# Altium schematic sheet SR.SchDoc
size A4; SheetNumber: 5; SheetTotal: 5
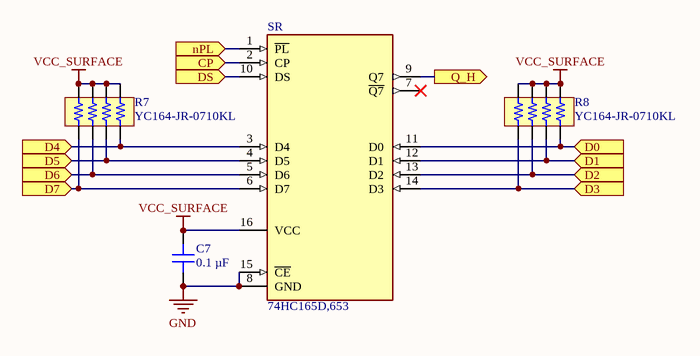
[diagram p0: SR.SchDoc]

## Parts
C7  0.1 µF  [CAP 0603_1608]
R7  YC164-JR-0710KL  [RESNET 1206-8 CONVEX]
R8  YC164-JR-0710KL  [RESNET 1206-8 CONVEX]
SR  74HC165D,653  [FP-SOT109-1-MFG]

## Ports
CP (in), D0 (in), D1 (in), D2 (in), D3 (in), D4 (in), D5 (in), D6 (in), D7 (in), DS (in), nPL (in), Q_H (out)

## Nets
GND: C7.1 SR.8(GND) SR.15(~{CE})
VCC_SURFACE: C7.2 R7.5 R7.6 R7.7 R7.8 R8.5 R8.6 R8.7 R8.8 SR.16(VCC)
CP: SR.2(CP) ; port CP
D0: R8.4 SR.11(D0) ; port D0
D1: R8.3 SR.12(D1) ; port D1
D2: R8.2 SR.13(D2) ; port D2
D3: R8.1 SR.14(D3) ; port D3
D4: R7.4 SR.3(D4) ; port D4
D5: R7.3 SR.4(D5) ; port D5
D6: R7.2 SR.5(D6) ; port D6
D7: R7.1 SR.6(D7) ; port D7
DS: SR.10(DS) ; port DS
nPL: SR.1(~{PL}) ; port nPL
Q_H: SR.9(Q7) ; port Q_H

Not connected (* = marked no-connect by the designer): SR 7(~{Q7})*

## Library data of the parts
C7 = CC0603KPX7R7BB104: CAP CER 0.1UF 16V X7R 0603; manufacturer: Yageo; Tolerance: ±10%; Part Number: CC0603KPX7R7BB104; Value: 0.1 µF; Applications: General Purpose; Capacitance: 0.1 µF; componentlink1description: Datasheet; componentlink1url: https://www.yageo.com/upload/media/product/productsearch/datasheet/mlcc/UPY-GPHC_X7R_6.3V-to-50V_18.pdf; componentlink2description: DigiKey Link; componentlink2url: https://www.digikey.com/en/products/detail/yageo/CC0603KPX7R7BB104/2103073; Device Package: 0603 (1608 Metric); lastupdated: 2/9/2024 8:10:09 PM; Lifecycle Status: Active; Minimum Order: 1; Mounting Type: Surface Mount, MLCC; Operating Temperature: -55°C ~ 125°C; Package / Case: 0603 (1608 Metric); packaging: TapeAndReel; partid: 16718; Part Status: Active; price: 0.01; series: CC; Size / Dimension: 0.063" L x 0.031" W (1.60mm x 0.80mm); Supplier 1: DigiKey; Supplier Part Number 1: 311-1335-1-ND; Temperature Coefficient: X7R; Thickness (Max): 0.035" (0.90mm); Voltage - Rated: 16V
R7 R8 = YC164-JR-0710KL: RES ARRAY 4 RES 10K OHM 1206; Manufacturer: Yageo; Circuit Type: Isolated; Number of Resistors: 4; Power Per Element: 62.5mW; Temperature Coefficient: ±200ppm/°C; Tolerance: ±5%; Part Number: YC164-JR-0710KL; Applications: DDRAM, SDRAM; ComponentLink1Description: Datasheet; ComponentLink1URL: https://www.yageo.com/upload/media/product/productsearch/datasheet/rchip/PYu-YC_TC_group_51_RoHS_L_9.pdf; ComponentLink2Description: DigiKey Link; ComponentLink2URL: http://digikey.com/product-detail/en/yageo/YC164-JR-0710KL/YC164J-10KCT-ND/1005702; Height - Seated (Max): 0.028" (0.70mm); LastUpdated: 9/2/2020 1:23:24 AM; Lifecycle Status: Active; Minimum Order: 1; Mounting Type: Surface Mount; Number of Pins: 8; Operating Temperature: -55°C ~ 155°C; Package / Case: 1206 (3216 Metric), Convex, Long Side Terminals; Packaging: TapeAndReel; PartId: 146; Part Status: Active; Price: 0.01; Resistance (Ohms): 10k; Series: YC164; Size / Dimension: 0.126" L x 0.063" W (3.20mm x 1.60mm); Supplier 1: DigiKey; Supplier Part Number 1: YC164J-10KCT-ND
SR = CMP-14351-000001-1: IC SHIFT REGST 8BIT PI-SO 16SOIC; Manufacturer: Nexperia; Standoff Height: 0.1mm; Number Of Inputs: 8; Logic Function Desc: Shift Register; Nominal Supply Current: 8uA; Number Of Circuits: 1; Propagation Delay: 15ns; Min Supply Voltage: 2V; Frequency: 61MHz; Max Supply Voltage: 6V; Height: 1.75mm; Digikey Description: IC SHIFT REGST 8BIT PI-SO 16SOIC; ComponentLink2URL: https://assets.nexperia.com/documents/data-sheet/74HC_HCT165.pdf; Ipc Land Pattern Name: SOP127P600X175-16; Temperature Range High: +125°C; Manufacturer Part Number: 74HC165D,653; Temperature: -40°C to +125°C; Device Class L2: Logic ICs; Device Class L1: Integrated Circuits (ICs); Lead Free: Yes; Number Of Outputs: 1; Ambient Temperature Range High: +125°C; ComponentLink2Description: Datasheet; Temperature Range Low: -40°C; Category: IC; RoHS: TRUE; Automotive: No; Device Class L3: Shift Registers; Octopart: https://octopart.com/74hc165d%2C653-nexperia-78737091; Footprint Url: https://assets.nexperia.com/documents/outline-drawing/SOT109-1.pdf; Ambient Temperature Range Low: -40°C; Package: SOT109-1